# EAGLE schematic KRP_SMproject#2 (EAGLE 9.4.2)
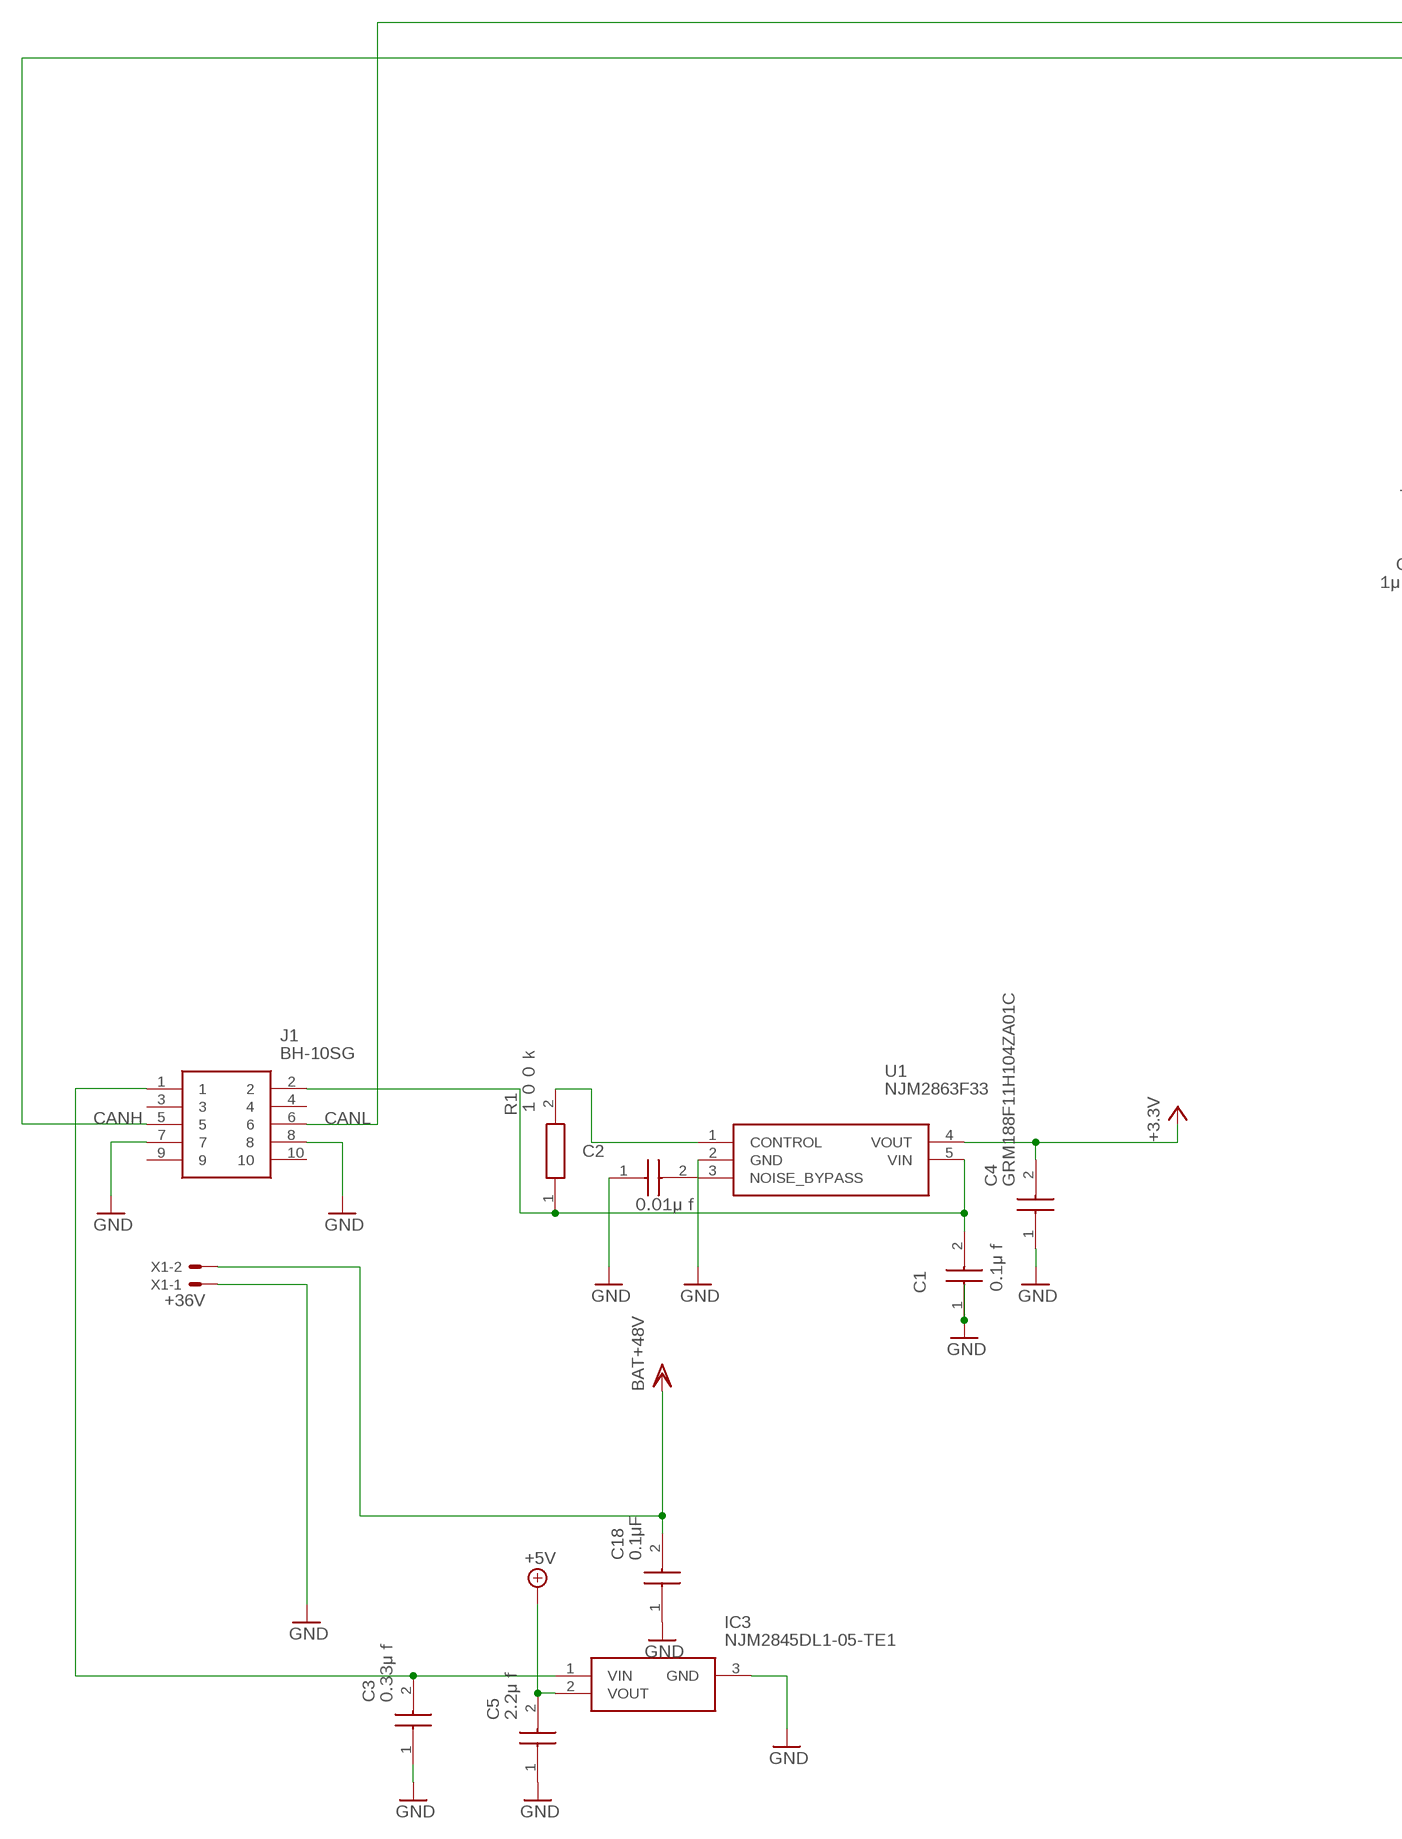
[diagram p0: schematic, sheet 1, part 1 of 2]
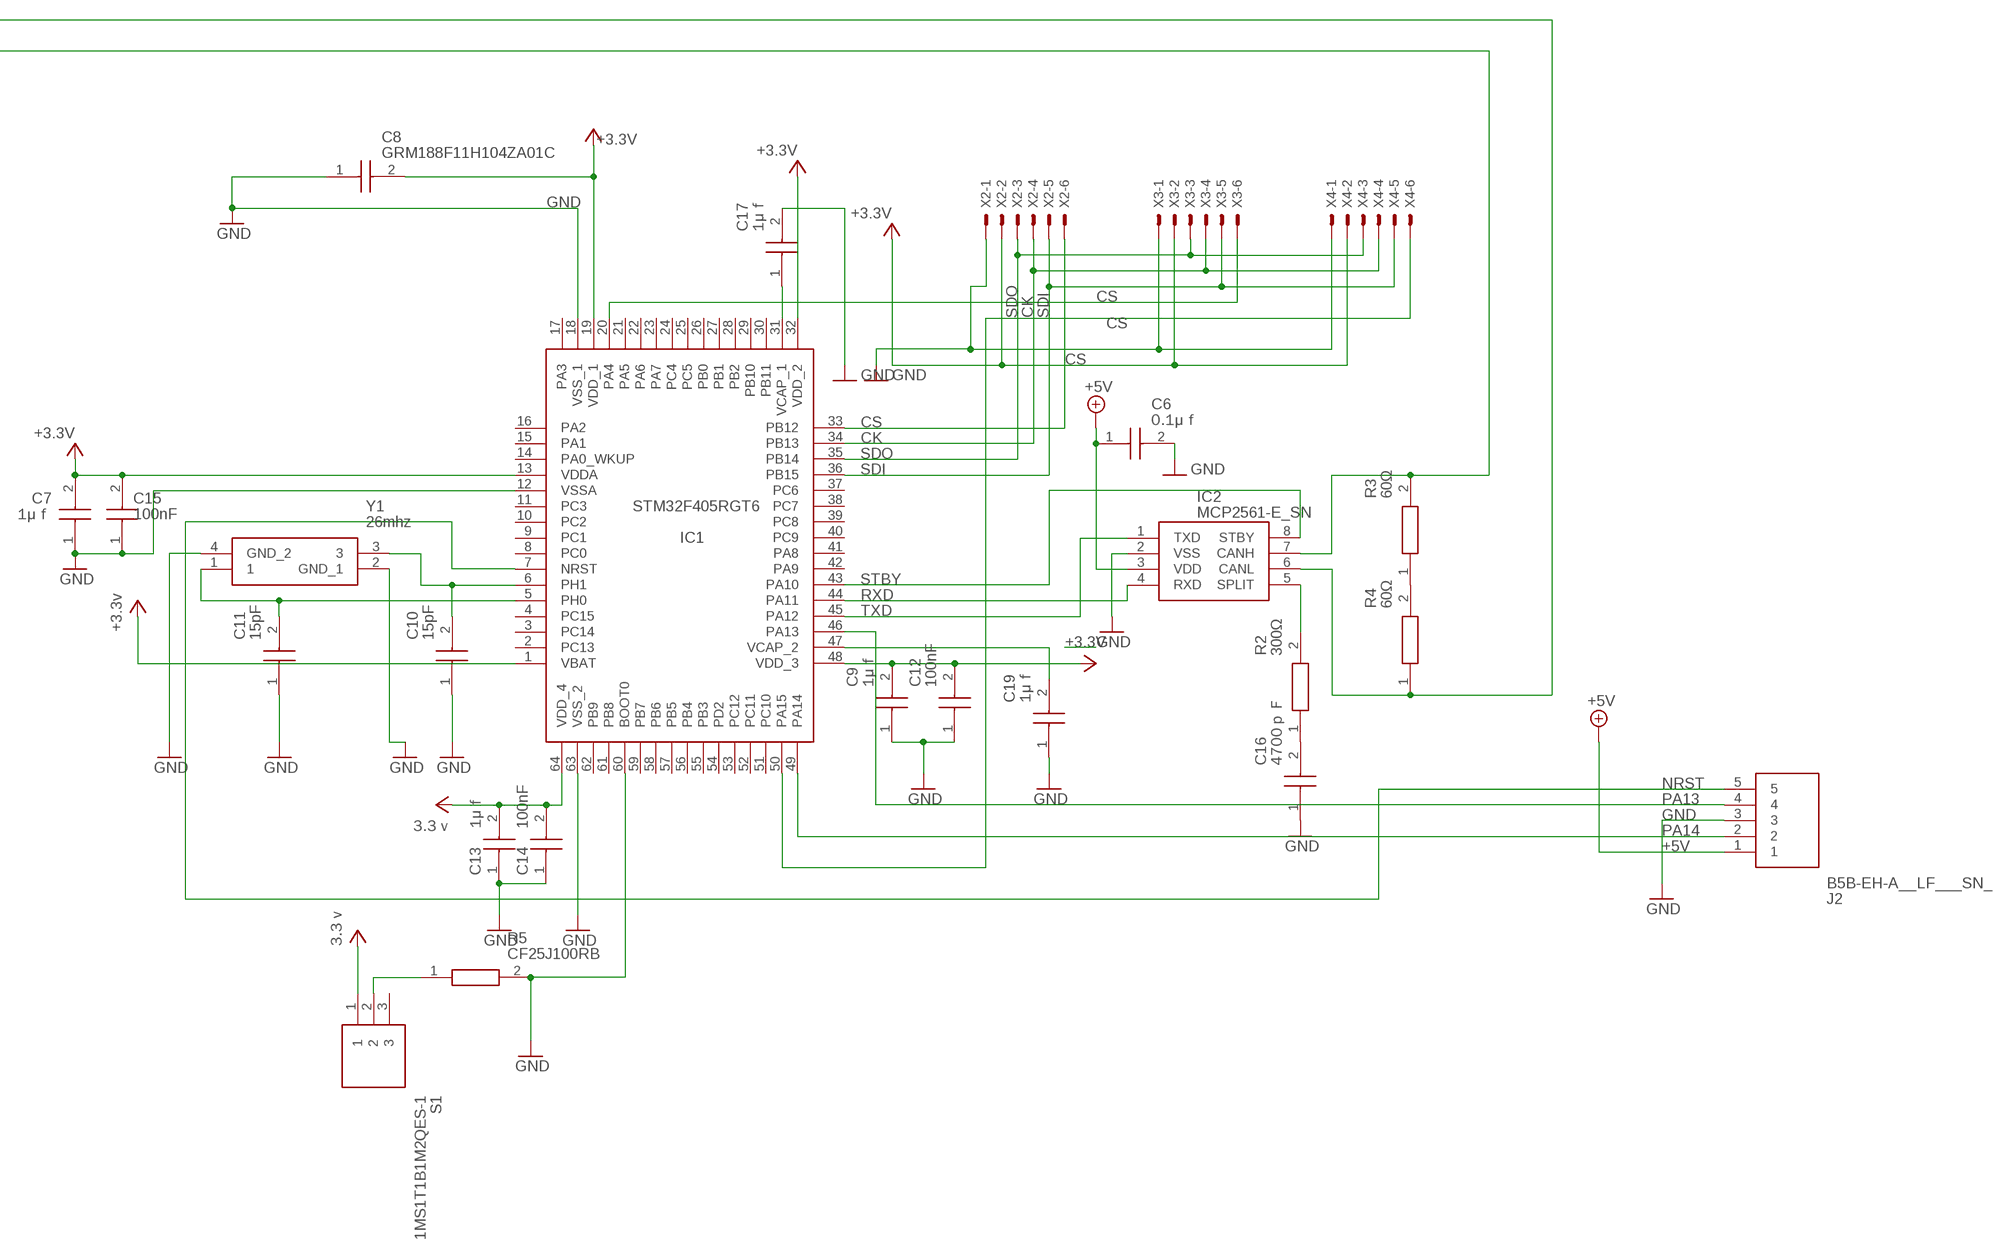
[diagram p1: schematic, sheet 1, part 2 of 2]

## Parts
C1  0.1μｆ  GRM188F11H104ZA01C  [CAPC1608X90N]
C2  0.01μｆ  GRM188F11H104ZA01C  [CAPC1608X90N]
C3  0.33μｆ  GRM188F11H104ZA01C  [CAPC1608X90N]
C4  GRM188F11H104ZA01C  [CAPC1608X90N]
C5  2.2μｆ  GRM188F11H104ZA01C  [CAPC1608X90N]
C6  0.1μｆ  GRM188F11H104ZA01C  [CAPC1608X90N]
C7  1μｆ  GRM188F11H104ZA01C  [CAPC1608X90N]
C8  GRM188F11H104ZA01C  [CAPC1608X90N]
C9  1μｆ  GRM188F11H104ZA01C  [CAPC1608X90N]
C10  15pF  GRM188F11H104ZA01C  [CAPC1608X90N]
C11  15pF  GRM188F11H104ZA01C  [CAPC1608X90N]
C12  100nF  GRM188F11H104ZA01C  [CAPC1608X90N]
C13  1μｆ  GRM188F11H104ZA01C  [CAPC1608X90N]
C14  100nF  GRM188F11H104ZA01C  [CAPC1608X90N]
C15  100nF  GRM188F11H104ZA01C  [CAPC1608X90N]
C16  4700ｐＦ  GRM188F11H104ZA01C  [CAPC1608X90N]
C17  1μｆ  GRM188F11H104ZA01C  [CAPC1608X90N]
C18  0.1μF  GRM188F11H104ZA01C  [CAPC1608X90N]
C19  1μｆ  GRM188F11H104ZA01C  [CAPC1608X90N]
IC1  STM32F405RGT6  [QFP50P1200X1200X160-64N]
IC2  MCP2561-E_SN  [SOIC127P600X175-8N]
IC3  NJM2845DL1-05-TE1  [TO-252-3-L1]
J1  BH-10SG  [SHDR10W64P254_2X5_2032X910X935]
J2  B5B-EH-A__LF___SN_  [SHDR5W64P0X250_1X5_1500X380X60]
R1  １００ｋ  RG1608N-101-W-T1  [RESC1608X50N]
R2  300Ω  RG1608N-101-W-T1  [RESC1608X50N]
R3  60Ω  RG1608N-101-W-T1  [RESC1608X50N]
R4  60Ω  RG1608N-101-W-T1  [RESC1608X50N]
R5  CF25J100RB  [RESAD1550W60L630D230]
S1  1MS1T1B1M2QES-1  [1MS1T1B1M2QES-5]
U1  NJM2863F33  [SOT95P280X130-5N]
X1  +36V  22-23-2021  [22-23-2021]
X2  22-23-2061  [22-23-2061]
X3  22-23-2061  [22-23-2061]
X4  22-23-2061  [22-23-2061]
Y1  26mhz  FA-128_32.0000MF20X-K3  [FA128]

## Nets
+5V: C4.2 C5.2 C6.1 C7.2 C8.2 C9.2 C12.2 C13.2 C14.2 C15.2 IC1.1(VBAT) IC1.13(VDDA) IC1.19(VDD_1) IC1.32(VDD_2) IC1.48(VDD_3) IC1.64(VDD_4) IC2.3(VDD) IC3.2(VOUT) J2.1 S1.1 U1.4(VOUT) X2.2 X3.2 X4.2 ; supply symbol labelled +3.3V, 3.3ｖ, +3.3v
CANH: IC2.7(CANH) J1.5 R3.2
CANL: IC2.6(CANL) J1.6 R4.1
CK: IC1.34(PB13) X2.4 X3.4 X4.4
CS: IC1.20(PA4) IC1.33(PB12) IC1.50(PA15) X2.6 X3.6 X4.6
GND: C1.1 C2.1 C3.1 C4.1 C5.1 C6.2 C7.1 C8.1 C9.1 C10.1 C11.1 C12.1 C13.1 C14.1 C15.1 C16.1 C17.2 C18.1 C19.1 IC1.12(VSSA) IC1.18(VSS_1) IC1.60(BOOT0) IC1.63(VSS_2) IC2.2(VSS) IC3.3(GND) J1.7 J1.8 J2.3 R5.2 U1.2(GND) X1.1 X2.1 X3.1 X4.1 Y1.2(GND_1) Y1.4(GND_2)
N$1: C1.2 J1.2 R1.1 U1.5(VIN)
N$2: R1.2 U1.1(CONTROL)
N$3: C3.2 IC3.1(VIN) J1.1
N$4: C2.2 U1.3(NOISE_BYPASS)
N$5: IC2.5(SPLIT) R2.2
N$6: C16.2 R2.1
N$7: C11.2 IC1.5(PH0) Y1.1
N$8: C10.2 IC1.6(PH1) Y1.3
N$9: R5.1 S1.2
N$10: C17.1 IC1.31(VCAP_1)
N$11: C19.2 IC1.47(VCAP_2)
N$13: R3.1 R4.2
NRST: IC1.7(NRST) J2.5
PA13: IC1.46(PA13) J2.4
PA14: IC1.49(PA14) J2.2
RXD: IC1.44(PA11) IC2.4(RXD)
SDI: IC1.36(PB15) X2.5 X3.5 X4.5
SDO: IC1.35(PB14) X2.3 X3.3 X4.3
STBY: IC1.43(PA10) IC2.8(STBY)
TXD: IC1.45(PA12) IC2.1(TXD)
VDD: C18.2 X1.2 ; supply symbol labelled BAT+48V
Unconnected: IC1.2(PC13) IC1.3(PC14) IC1.4(PC15) IC1.8(PC0) IC1.9(PC1) IC1.10(PC2) IC1.11(PC3) IC1.14(PA0_WKUP) IC1.15(PA1) IC1.16(PA2) IC1.17(PA3) IC1.21(PA5) IC1.22(PA6) IC1.23(PA7) IC1.24(PC4) IC1.25(PC5) IC1.26(PB0) IC1.27(PB1) IC1.28(PB2) IC1.29(PB10) IC1.30(PB11) IC1.37(PC6) IC1.38(PC7) IC1.39(PC8) IC1.40(PC9) IC1.41(PA8) IC1.42(PA9) IC1.51(PC10) IC1.52(PC11) IC1.53(PC12) IC1.54(PD2) IC1.55(PB3) IC1.56(PB4) IC1.57(PB5) IC1.58(PB6) IC1.59(PB7) IC1.61(PB8) IC1.62(PB9) J1.3 J1.4 J1.9 J1.10 S1.3

## Library data of the parts
C1-C19 = GRM188F11H104ZA01C:GRM188F11H104ZA01C: Multilayer Ceramic Capacitors MLCC - SMD/SMT Source: Datasheet <http://componentsearchengine.com/Datasheets/1/GRM188F11H104ZA01C.pdf>; DESCRIPTION: Multilayer Ceramic Capacitors MLCC - SMD/SMT; HEIGHT: 0.9mm; MANUFACTURER_NAME: Murata Electronics; MANUFACTURER_PART_NUMBER: GRM188F11H104ZA01C
IC1 = STM32F405RGT6:STM32F405RGT6: MCU 32-Bit, ARM Cortex M4, 1MB Flash STMicroelectronics STM32F405RGT6, 32bit ARM Cortex M4F Microcontroller, 168MHz, 1024 kB Flash, 64-Pin LQFP Source: Datasheet <http://uk.rs-online.com/web/p/products/7468217P>; ALLIED_NUMBER: 70391099; DESCRIPTION: MCU 32-Bit, ARM Cortex M4, 1MB Flash STMicroelectronics STM32F405RGT6, 32bit ARM Cortex M4F Microcontroller, 168MHz, 1024 kB Flash, 64-Pin LQFP; HEIGHT: 1.6mm; MANUFACTURER_NAME: STMicroelectronics; MANUFACTURER_PART_NUMBER: STM32F405RGT6; RS_PART_NUMBER: 7468217P; RS_PRICE-STOCK: http://uk.rs-online.com/web/p/products/7468217P
IC2 = MCP2561-E_SN:MCP2561-E_SN: CAN Transceiver 1Mbps 5V 125degC SOIC8 Microchip MCP2561-E/SN, CAN Transceiver 1MBps 1-channel IEC 61000-4-2, 8-Pin SOIC Source: Datasheet <http://uk.rs-online.com/web/p/products/7990216P>; ALLIED_NUMBER: 70415103; DESCRIPTION: CAN Transceiver 1Mbps 5V 125degC SOIC8 Microchip MCP2561-E/SN, CAN Transceiver 1MBps 1-channel IEC 61000-4-2, 8-Pin SOIC; HEIGHT: 1.75mm; MANUFACTURER_NAME: Microchip; MANUFACTURER_PART_NUMBER: MCP2561-E/SN; RS_PART_NUMBER: 7990216P; RS_PRICE-STOCK: http://uk.rs-online.com/web/p/products/7990216P
IC3 = NJM2845DL1-05-TE1:NJM2845DL1-05-TE1: LDO Voltage Regulators LDO w/On/Off Cntrl Source: Datasheet <http://www.njr.com/semicon/PDF/NJM2845_NJM2846_E.pdf>; DESCRIPTION: LDO Voltage Regulators LDO w/On/Off Cntrl; HEIGHT: mm; MANUFACTURER_NAME: NJR; MANUFACTURER_PART_NUMBER: NJM2845DL1-05-TE1
J1 = BH-10SG:BH-10SG: ic Source: Datasheet <http://akizukidenshi.com/download/ds/useconn/BH-XXSG.pdf>; DESCRIPTION: ic; HEIGHT: 9.35mm; MANUFACTURER_NAME: Useconn Electronics; MANUFACTURER_PART_NUMBER: BH-10SG
J2 = B5B-EH-A__LF___SN_:B5B-EH-A__LF___SN_: 5 way 1 row top entry header,2.5mm pitch JST EH Series, 2.5mm Pitch 5 Way 1 Row Straight PCB Header, Solder Termination, 3A Source: Datasheet <http://uk.rs-online.com/web/p/products/5151412P>; DESCRIPTION: 5 way 1 row top entry header,2.5mm pitch JST EH Series, 2.5mm Pitch 5 Way 1 Row Straight PCB Header, Solder Termination, 3A; HEIGHT: 6mm; MANUFACTURER_NAME: JST (JAPAN SOLDERLESS TERMINALS); MANUFACTURER_PART_NUMBER: B5B-EH-A (LF) (SN); RS_PART_NUMBER: 5151412P; RS_PRICE-STOCK: http://uk.rs-online.com/web/p/products/5151412P
R1-R4 = RG1608N-101-W-T1:RG1608N-101-W-T1: Thin Film Resistors - SMD 1/10W 100 Ohms 0.05% 0603 10ppm Source: Datasheet <http://uk.rs-online.com/web/p/products/0160452>; DESCRIPTION: Thin Film Resistors - SMD 1/10W 100 Ohms 0.05% 0603 10ppm; HEIGHT: 0.5mm; MANUFACTURER_NAME: Susumu; MANUFACTURER_PART_NUMBER: RG1608N-101-W-T1; RS_PART_NUMBER: 0160452; RS_PRICE-STOCK: http://uk.rs-online.com/web/p/products/0160452
R5 = CF25J100RB:CF25J100RB: Carbon Film Fixed Resistors Source: Datasheet <http://akizukidenshi.com/download/ds/faithful/R1_CF.pdf>; DESCRIPTION: Carbon Film Fixed Resistors; HEIGHT: mm; MANUFACTURER_NAME: Faithful Link; MANUFACTURER_PART_NUMBER: CF25J100RB
S1 = 1MS1T1B1M2QES-1:1MS1T1B1M2QES-1: Toggle Switch SPDT On-On, 5 A, PCB Source: Datasheet; DESCRIPTION: Toggle Switch SPDT On-On, 5 A, PCB; HEIGHT: mm; MANUFACTURER_NAME: RS Components; MANUFACTURER_PART_NUMBER: 1MS1T1B1M2QES-1
U1 = NJM2863F33:NJM2863F33: Ultra Low Noise Low Dropout Voltage Regulator, SOT-23-5 Source: Datasheet <http://www.njr.com/semicon/PDF/NJM2863_NJM2864_E.pdf>; DESCRIPTION: Ultra Low Noise Low Dropout Voltage Regulator, SOT-23-5; HEIGHT: 1.3mm; MANUFACTURER_NAME: NJR; MANUFACTURER_PART_NUMBER: NJM2863F33
X1 = con-molex:22-23-2021: .100" (2.54mm) Center Header - 2 Pin; MF: MOLEX; MPN: 22-23-2021; OC_FARNELL: 1462926; OC_NEWARK: 25C3832
X2-X4 = con-molex:22-23-2061: .100" (2.54mm) Center Header - 6 Pin; MF: MOLEX; MPN: 22-23-2061; OC_FARNELL: 1462922; OC_NEWARK: 27C1933
Y1 = FA-128_32.0000MF20X-K3:FA-128_32.0000MF20X-K3: MHz range crystal unit, FA-128 Source: Datasheet <https://support.epson.biz/td/api/doc_check.php?dl=brief_FA-128&lang=en>; DESCRIPTION: MHz range crystal unit, FA-128; HEIGHT: mm; MANUFACTURER_NAME: Epson Timing; MANUFACTURER_PART_NUMBER: FA-128 32.0000MF20X-K3